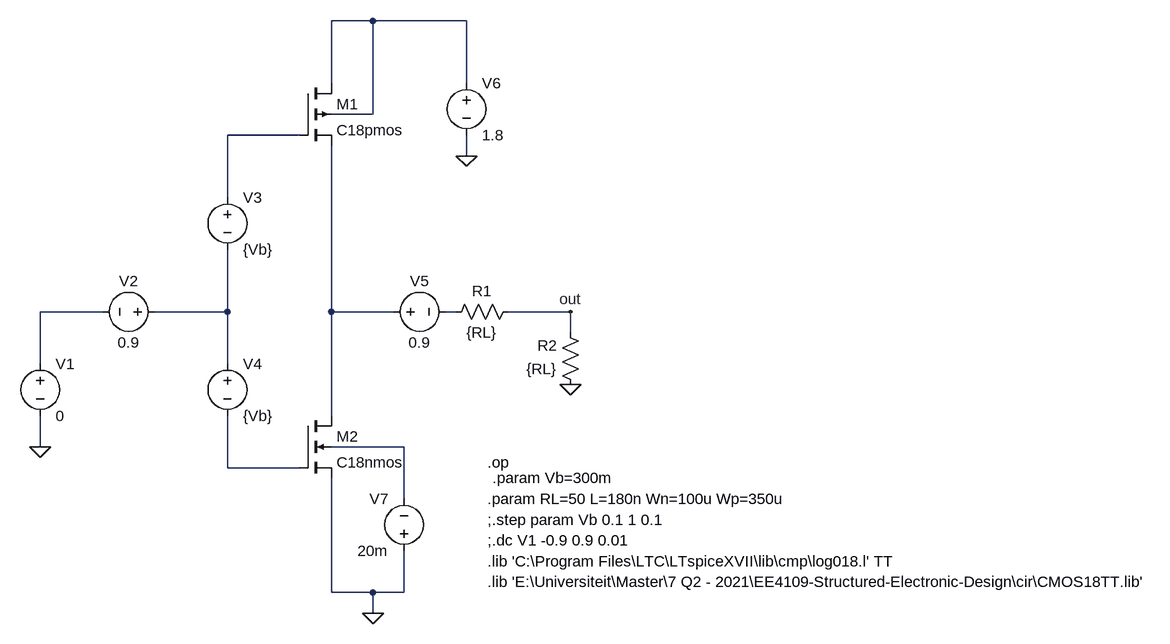
[diagram p0: schematic OutputStageBiased.asc]
OutputStageBiased.asc, the LTspice schematic file:
Version 4
SHEET 1 1592 680
WIRE 448 -368 384 -368
WIRE 592 -368 448 -368
WIRE 384 -272 384 -368
WIRE 592 -272 592 -368
WIRE 448 -224 448 -368
WIRE 448 -224 384 -224
WIRE 336 -192 224 -192
WIRE 592 -160 592 -192
WIRE 224 -96 224 -192
WIRE 32 80 -64 80
WIRE 224 80 224 -16
WIRE 224 80 112 80
WIRE 384 80 384 -176
WIRE 480 80 384 80
WIRE 576 80 560 80
WIRE 752 80 656 80
WIRE 752 112 752 80
WIRE -64 160 -64 80
WIRE 224 160 224 80
WIRE 384 240 384 80
WIRE -64 288 -64 240
WIRE 496 288 384 288
WIRE 224 320 224 240
WIRE 336 320 224 320
WIRE 496 368 496 288
WIRE 384 512 384 336
WIRE 448 512 384 512
WIRE 496 512 496 448
WIRE 496 512 448 512
WIRE 448 544 448 512
FLAG -64 288 0
FLAG 592 -160 0
FLAG 448 544 0
FLAG 752 192 0
FLAG 752 80 out
DATAFLAG 256 -224 "Id(M1)"
DATAFLAG 272 368 "Id(M2)"
SYMBOL voltage -64 144 R0
SYMATTR InstName V1
SYMATTR Value 0
SYMBOL voltage 128 80 R90
WINDOW 0 -32 56 VBottom 2
WINDOW 3 32 56 VTop 2
SYMATTR InstName V2
SYMATTR Value 0.9
SYMBOL voltage 224 -112 R0
WINDOW 123 0 0 Left 0
WINDOW 39 0 0 Left 0
SYMATTR InstName V3
SYMATTR Value {Vb}
SYMBOL voltage 224 144 R0
SYMATTR InstName V4
SYMATTR Value {Vb}
SYMBOL pmos4 336 -272 R0
SYMATTR InstName M1
SYMATTR Value C18pmos
SYMATTR Value2 l={L} w={Wp}
SYMBOL nmos4 336 240 R0
SYMATTR InstName M2
SYMATTR Value C18nmos
SYMATTR Value2 l={L} w={Wn}
SYMBOL voltage 464 80 R270
WINDOW 0 32 56 VTop 2
WINDOW 3 -32 56 VBottom 2
SYMATTR InstName V5
SYMATTR Value 0.9
SYMBOL res 672 64 R90
WINDOW 0 0 56 VBottom 2
WINDOW 3 32 56 VTop 2
SYMATTR InstName R1
SYMATTR Value {RL}
SYMBOL voltage 592 -288 R0
SYMATTR InstName V6
SYMATTR Value 1.8
SYMBOL voltage 496 464 R180
WINDOW 0 24 96 Left 2
WINDOW 3 24 16 Left 2
WINDOW 123 0 0 Left 0
WINDOW 39 0 0 Left 0
SYMATTR InstName V7
SYMATTR Value 20m
SYMBOL res 768 208 R180
WINDOW 0 36 76 Left 2
WINDOW 3 36 40 Left 2
SYMATTR InstName R2
SYMATTR Value {RL}
TEXT 624 368 Left 2 !.param RL=50 L=180n Wn=100u Wp=350u
TEXT 624 400 Left 2 !;.step param Vb 0.1 1 0.1
TEXT 624 432 Left 2 !;.dc V1 -0.9 0.9 0.01
TEXT 624 464 Left 2 !.lib 'C:\\Program Files\\LTC\\LTspiceXVII\\lib\\cmp\\log018.l' TT
TEXT 624 496 Left 2 !.lib 'E:\\Universiteit\\Master\\7 Q2 - 2021\\EE4109-Structured-Electronic-Design\\cir\\CMOS18TT.lib'
TEXT 632 336 Left 2 !.param Vb=300m
TEXT 624 312 Left 2 !.op

The netlist it stands for:
* OutputStageBiased.asc
V1 N003 0 0
V2 N004 N003 0.9
V3 N002 N004 {Vb}
V4 N004 N008 {Vb}
M1 N001 N002 N005 N001 C18pmos l={L} w={Wp}
M2 N005 N008 0 N007 C18nmos l={L} w={Wn}
V5 N005 N006 0.9
R1 out N006 {RL}
V6 N001 0 1.8
V7 0 N007 20m
R2 0 out {RL}
.model NMOS NMOS
.model PMOS PMOS
.lib standard.mos
.param RL=50 L=180n Wn=100u Wp=350u
;.step param Vb 0.1 1 0.1
;.dc V1 -0.9 0.9 0.01
.lib 'C:\Program Files\LTC\LTspiceXVII\lib\cmp\log018.l' TT
.lib 'E:\Universiteit\Master\7 Q2 - 2021\EE4109-Structured-Electronic-Design\cir\CMOS18TT.lib'
.param Vb=300m
.op
.backanno
.end